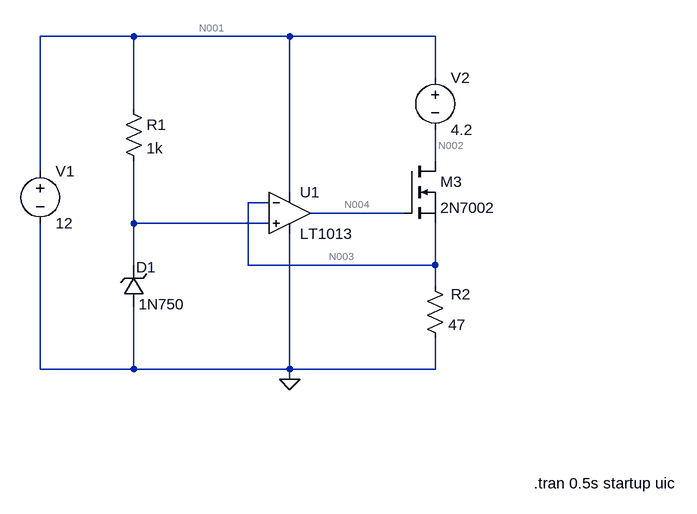
[diagram p0: schematic Charger.asc]
Charger.asc, the LTspice schematic file:
Version 4
SHEET 1 1196 680
WIRE 112 -160 -32 -160
WIRE 352 -160 112 -160
WIRE 576 -160 352 -160
WIRE 576 -96 576 -160
WIRE 112 -48 112 -160
WIRE 576 32 576 -16
WIRE -32 48 -32 -160
WIRE 352 80 352 -160
WIRE 320 96 288 96
WIRE 528 112 384 112
WIRE 112 128 112 32
WIRE 320 128 112 128
WIRE 112 192 112 128
WIRE 288 192 288 96
WIRE 576 192 576 128
WIRE 576 192 288 192
WIRE 576 224 576 192
WIRE -32 352 -32 128
WIRE 112 352 112 256
WIRE 112 352 -32 352
WIRE 352 352 352 144
WIRE 352 352 112 352
WIRE 576 352 576 304
WIRE 576 352 352 352
WIRE 352 368 352 352
FLAG 352 368 0
SYMBOL res 96 -64 R0
SYMATTR InstName R1
SYMATTR Value 1k
SYMBOL res 560 208 R0
WINDOW 0 40 29 Left 2
SYMATTR InstName R2
SYMATTR Value 47
SYMBOL voltage -32 32 R0
WINDOW 123 0 0 Left 0
WINDOW 39 0 0 Left 0
SYMATTR InstName V1
SYMATTR Value 12
SYMBOL zener 128 256 R180
WINDOW 0 -18 61 Left 2
WINDOW 3 -63 4 Left 2
SYMATTR InstName D1
SYMATTR Value 1N750
SYMBOL voltage 576 -112 R0
WINDOW 123 0 0 Left 0
WINDOW 39 0 0 Left 0
SYMATTR InstName V2
SYMATTR Value 4.2
SYMBOL Opamps\\LT1013 352 48 R0
SYMATTR InstName U1
SYMBOL nmos 528 32 R0
SYMATTR InstName M3
SYMATTR Value 2N7002
TEXT 728 528 Left 2 !.tran 0.5s startup uic

The netlist it stands for:
* Charger.asc
R1 N001 N005 1k
R2 N003 0 47
V1 N001 0 12
D1 0 N005 1N750
V2 N001 N002 4.2
XU1 N005 N003 N001 0 N004 LT1013  ; pins In+ In- V+ V- OUT
M3 N002 N004 N003 N003 2N7002
.model D D
.lib standard.dio
.model NMOS NMOS
.model PMOS PMOS
.lib standard.mos
.tran 0.5s startup uic
.lib LTC.lib
.backanno
.end

* Results of the author's LTspice run, read from the files saved beside the schematic
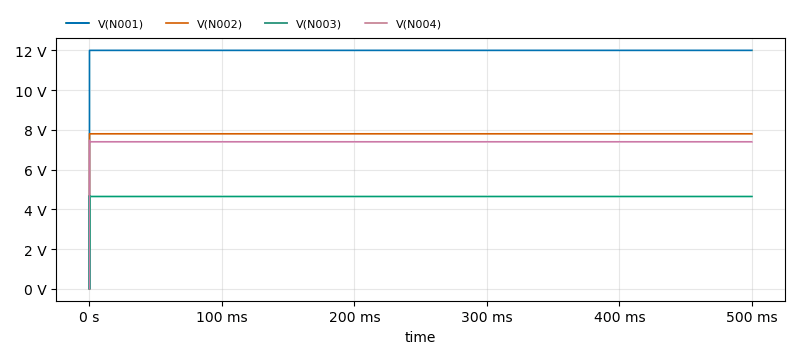
[diagram p1: Transient Analysis of Charger.asc, plotted from the saved traces]
* Transient Analysis, 1 run:
*   V(N001): min 0 V, max 12 V, average 12 V, rms 12 V, last 12 V
*   V(N002): min 0 V, max 7.8 V, average 7.8 V, rms 7.8 V, last 7.8 V
*   V(N003): min -506.7 µV, max 4.705 V, average 4.646 V, rms 4.646 V, last 4.646 V
*   V(N004): min 0 V, max 7.465 V, average 7.398 V, rms 7.398 V, last 7.398 V